# EAGLE schematic explorator_breakout_pcb_40mm_v2 (EAGLE 9.6.2)
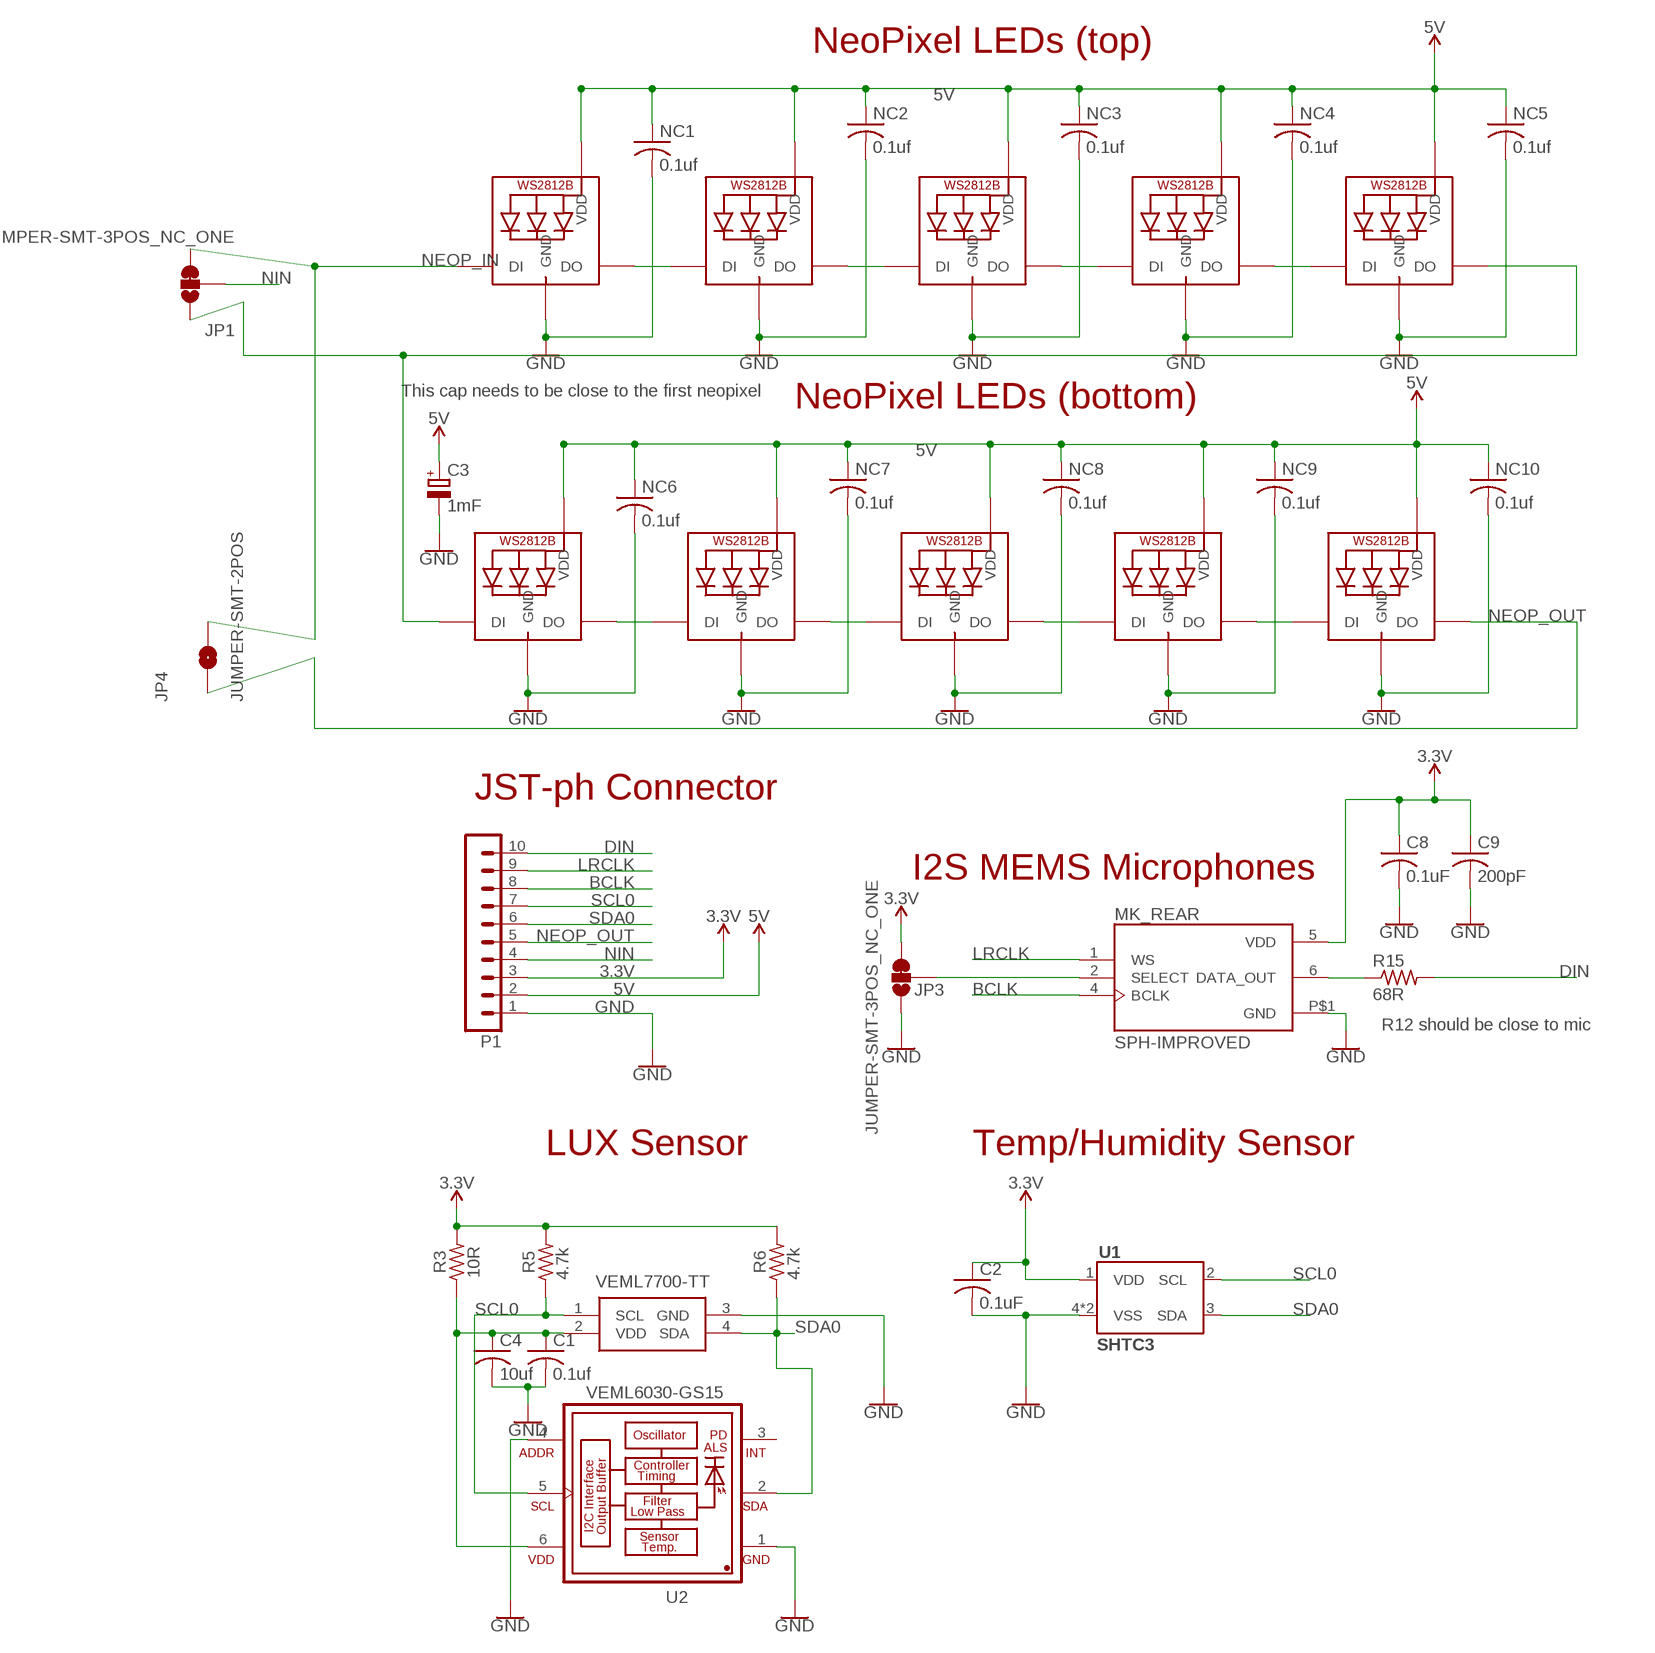
[diagram p0: schematic, sheet 1]

## Parts
C1  0.1uf  C-USC0805  [C0805]
C2  0.1uF  C-USC0805  [C0805]
C3  1mF  CPOL-EU153CLV-1012  [153CLV-1012]
C4  10uf  C-USC0805  [C0805]
C8  0.1uF  C-USC0805  [C0805]
C9  200pF  C-USC0805  [C0805]
JP1  JUMPER-SMT-3POS_NC_ONE  [SMT-JUMPER_3_1-NC_TRACE_NO-SILK]
JP3  JUMPER-SMT-3POS_NC_ONE  [SMT-JUMPER_3_1-NC_TRACE_NO-SILK]
JP4  JUMPER-SMT-2POS  [SMT-JUMPER_2_NO_NO-SILK]
MK_REAR  SPH-IMPROVED  [MIC_SPH0645LM4H-B_LARGER_RING]
NC1  0.1uf  C-USC0805  [C0805]
NC2  0.1uf  C-USC0805  [C0805]
NC3  0.1uf  C-USC0805  [C0805]
NC4  0.1uf  C-USC0805  [C0805]
NC5  0.1uf  C-USC0805  [C0805]
NC6  0.1uf  C-USC0805  [C0805]
NC7  0.1uf  C-USC0805  [C0805]
NC8  0.1uf  C-USC0805  [C0805]
NC9  0.1uf  C-USC0805  [C0805]
NC10  0.1uf  C-USC0805  [C0805]
NEO_01  WS2812  [WS2812B]
NEO_02  WS2812  [WS2812B]
NEO_03  WS2812  [WS2812B]
NEO_04  WS2812  [WS2812B]
NEO_05  WS2812  [WS2812B]
NEO_06  WS2812  [WS2812B]
NEO_07  WS2812  [WS2812B]
NEO_08  WS2812  [WS2812B]
NEO_09  WS2812  [WS2812B]
NEO_10  WS2812  [WS2812B]
P1  B10B-PH-K  [B10B-PH-K]
R3  10R  R-US_R0805  [R0805]
R5  4.7k  R-US_R0805  [R0805]
R6  4.7k  R-US_R0805  [R0805]
R15  68R  R-US_R0805  [R0805]
U1  SHTC3  [SHTC3]
U2  VEML6030-GS15  [VISHAY_VEML6030_2X2X0.87]
VEML_F  VEML7700-TT  [VEML7700]

## Nets
3.3V: C2.1 C8.1 C9.1 JP3.3 MK_REAR.5(VDD) P1.3 R3.2 R5.2 R6.2 U1.1(VDD)
5V: C3.+ NC1.1 NC2.1 NC3.1 NC4.1 NC5.1 NC6.1 NC7.1 NC8.1 NC9.1 NC10.1 NEO_01.1-VDD(VDD) NEO_02.1-VDD(VDD) NEO_03.1-VDD(VDD) NEO_04.1-VDD(VDD) NEO_05.1-VDD(VDD) NEO_06.1-VDD(VDD) NEO_07.1-VDD(VDD) NEO_08.1-VDD(VDD) NEO_09.1-VDD(VDD) NEO_10.1-VDD(VDD) P1.2
BCLK: MK_REAR.4(BCLK) P1.8
DIN: P1.10 R15.2
GND: C1.2 C2.2 C3.- C4.2 C8.2 C9.2 JP3.1 MK_REAR.P$1(GND) NC1.2 NC2.2 NC3.2 NC4.2 NC5.2 NC6.2 NC7.2 NC8.2 NC9.2 NC10.2 NEO_01.3-GND(GND) NEO_02.3-GND(GND) NEO_03.3-GND(GND) NEO_04.3-GND(GND) NEO_05.3-GND(GND) NEO_06.3-GND(GND) NEO_07.3-GND(GND) NEO_08.3-GND(GND) NEO_09.3-GND(GND) NEO_10.3-GND(GND) P1.1 U1.4(VSS) U1.5(VSS) U2.1(GND) U2.4(ADDR) VEML_F.3(GND)
LRCLK: MK_REAR.1(WS) P1.9
N$1: C1.1 C4.1 R3.1 U2.6(VDD) VEML_F.2(VDD)
N$2: JP1.1 NEO_05.2-DOUT(DO) NEO_06.4-DIN(DI)
N$4: NEO_02.2-DOUT(DO) NEO_03.4-DIN(DI)
N$5: NEO_09.2-DOUT(DO) NEO_10.4-DIN(DI)
N$6: JP3.2 MK_REAR.2(SELECT)
N$7: NEO_07.2-DOUT(DO) NEO_08.4-DIN(DI)
N$8: NEO_04.2-DOUT(DO) NEO_05.4-DIN(DI)
N$9: NEO_08.2-DOUT(DO) NEO_09.4-DIN(DI)
N$10: NEO_03.2-DOUT(DO) NEO_04.4-DIN(DI)
N$17: MK_REAR.6(DATA_OUT) R15.1
NEO_P1: NEO_01.2-DOUT(DO) NEO_02.4-DIN(DI)
NEO_P2: NEO_06.2-DOUT(DO) NEO_07.4-DIN(DI)
NEOP_IN: JP1.3 JP4.2 NEO_01.4-DIN(DI)
NEOP_OUT: JP4.1 NEO_10.2-DOUT(DO) P1.5
NIN: JP1.2 P1.4
SCL0: P1.7 R5.1 U1.2(SCL) U2.5(SCL) VEML_F.1(SCL)
SDA0: P1.6 R6.1 U1.3(SDA) U2.2(SDA) VEML_F.4(SDA)
Unconnected: U2.3(INT)

## Notes on the sheet
- NeoPixel LEDs (top)
- This cap needs to be close to the first neopixel
- NeoPixel LEDs (bottom)
- JST-ph Connector
- I2S MEMS Microphones
- R12 should be close to mic
- LUX Sensor | Temp/Humidity Sensor
- 10R | 4.7k | 4.7k

## Library data of the parts
C1 C2 C4 C8 C9 NC1-NC10 = rcl:C-US: CAPACITOR, American symbol; SPICEPREFIX: C
C3 = rcl:CPOL-EU: POLARIZED CAPACITOR, European symbol; SPICEPREFIX: C
JP1 JP3 = nathans-custom-parts:JUMPER-SMT-3POS_NC_ONE
JP4 = nathans-custom-parts:JUMPER-SMT-2POS
MK_REAR = SPH0645LM4H-B:SPH-IMPROVED
NEO_01-NEO_09 NEO_10 = WS2812B:WS2812
P1 = con-jst-ph:B10B-PH-K: HEADER
R3 R5 R6 R15 = PulseOximeterECG_AU:R-US_: RESISTOR, American symbol; SPICEPREFIX: R
U1 = SHTC3:SHTC3
U2 = VEML6030-GS15:VEML6030-GS15: VEML6030 High Accuracy Ambient Light Sensor with I2C Interface: VEML6030 is a high accuracy ambient light digital 16-bit resolution sensor in a miniature transparent 2 mm x 2 mm package. It includes a high sensitive photodiode, a low noise amplifier, a 16-bit A/D converter and supports an easy to use I2C bus communication interface and additional interrupt feature. The ambient light result is as digital value available. Device Model created 15.06.2016 by Johannes Kolb - Vishay Semiconductor GmbH; AVAILABILITY: Unavailable; DESCRIPTION: Optical Sensor Ambient 550nm I²C 6-SMD, No Lead; MF: Vishay Semiconductor; MP: VEML6030-GS15; PACKAGE: SMD-6 Vishay; PRICE: None
VEML_F = VEML7700-TT:VEML7700-TT: 16Bit Ambient Light Sensor I2C 6.8x2.3mm Source: Datasheet <https://www.arrow.com/en/products/veml7700-tt/vishay>; DESCRIPTION: 16Bit Ambient Light Sensor I2C 6.8x2.3mm; HEIGHT: mm; MANUFACTURER_NAME: Vishay; MANUFACTURER_PART_NUMBER: VEML7700-TT; MOUSER_PART_NUMBER: 78-VEML7700-TT; MOUSER_PRICE-STOCK: https://www.mouser.com/Search/Refine.aspx?Keyword=78-VEML7700-TT; RS_PART_NUMBER: 1226791P; RS_PRICE-STOCK: http://uk.rs-online.com/web/p/products/1226791P

## Net classes
0 default: width 0.203 mm, drill 0.254 mm, clearance 0.203 mm